# EAGLE schematic connector (EAGLE 8.3.2)
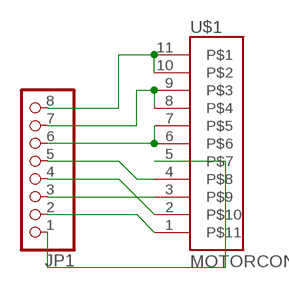
[diagram p0: schematic, sheet 1]

## Parts
JP1  PINHD-1X8  [1X08]
U$1  MOTORCON  [GEN3CON]

## Nets
M1: JP1.8 U$1.10 U$1.11
M2: JP1.7 U$1.8 U$1.9
M3: JP1.6 U$1.6 U$1.7
N$3: JP1.5 U$1.4
N$4: JP1.1 U$1.5
N$5: JP1.4 U$1.2
N$6: JP1.3 U$1.3
N$7: JP1.2 U$1.1

## Library data of the parts
JP1 = pinhead:PINHD-1X8: PIN HEADER
U$1 = gen3:MOTORCON: Motor Connector bottom side connector for ribbon cable